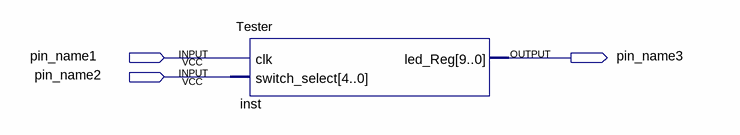
[diagram p0: schematic sheet]
// Quartus schematic Process1.bdf as structural Verilog: 1 symbols, 3 pins
module Process1 (
  input  pin_name1,
  input  pin_name2,
  output pin_name3
);

  Tester inst (.clk(pin_name1), .switch_select({5{pin_name2}}), .led_Reg(pin_name3));
endmodule
